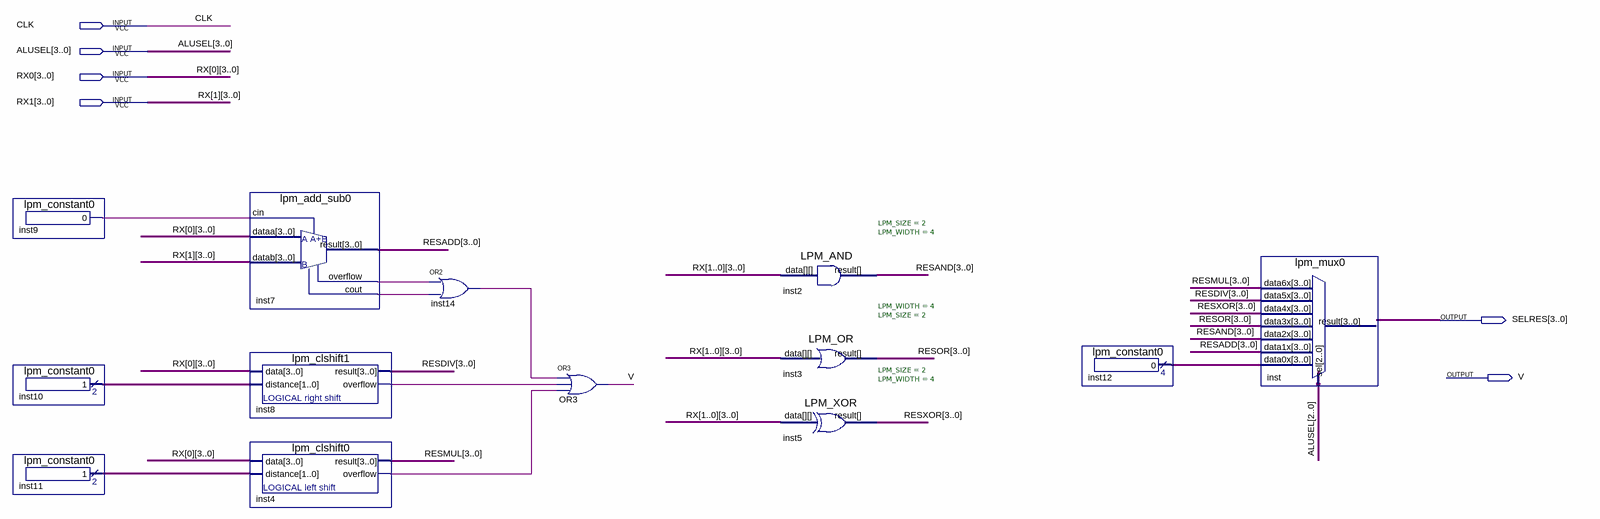
[diagram p0: schematic sheet]
// Quartus schematic ALU.bdf as structural Verilog: 13 symbols, 6 pins
module ALU (
  input  CLK,
  input  [3:0] ALUSEL,
  input  [3:0] RX0,
  input  [3:0] RX1,
  output [3:0] SELRES,
  output V
);

  wire inst4_overflow, inst7_cout, inst7_overflow, inst8_overflow, inst9_result, inst14_out;
  wire [1:0] inst10_result, inst11_result;
  wire [3:0] inst12_result, RESADD, RESAND, RESDIV, RESMUL, RESOR, RESXOR;

  lpm_constant0 inst9 (.result(inst9_result));
  lpm_constant0 inst10 (.result(inst10_result));
  lpm_constant0 inst11 (.result(inst11_result));
  lpm_add_sub0 inst7 (
    .cin(inst9_result), .dataa(RX0), .datab(RX1), .result(RESADD), .overflow(inst7_overflow),
    .cout(inst7_cout));
  lpm_clshift1 inst8 (.data(RX0), .distance(inst10_result), .result(RESDIV), .overflow(inst8_overflow));
  lpm_clshift0 inst4 (.data(RX0), .distance(inst11_result), .result(RESMUL), .overflow(inst4_overflow));
  or inst14 (inst14_out, inst7_overflow, inst7_cout);
  or OR3 (V, inst14_out, inst8_overflow, inst4_overflow);
  LPM_AND #(.LPM_SIZE(2), .LPM_WIDTH(4)) inst2 (.data({RX1, RX0}), .result(RESAND));
  LPM_OR #(.LPM_WIDTH(4), .LPM_SIZE(2)) inst3 (.data({RX1, RX0}), .result(RESOR));
  LPM_XOR #(.LPM_SIZE(2), .LPM_WIDTH(4)) inst5 (.data({RX1, RX0}), .result(RESXOR));
  lpm_constant0 inst12 (.result(inst12_result));
  lpm_mux0 inst (
    .data6x(RESMUL), .data5x(RESDIV), .data4x(RESXOR), .data3x(RESOR), .data2x(RESAND), .data1x(RESADD),
    .data0x(inst12_result), .sel(ALUSEL[2:0]));  // open: result

  // Other names for the same wires on the sheet: RX_0[3:0] = RX0; RX_1[3:0] = RX1
endmodule
